# EAGLE schematic LedCtlV2 (EAGLE 6.6.0)
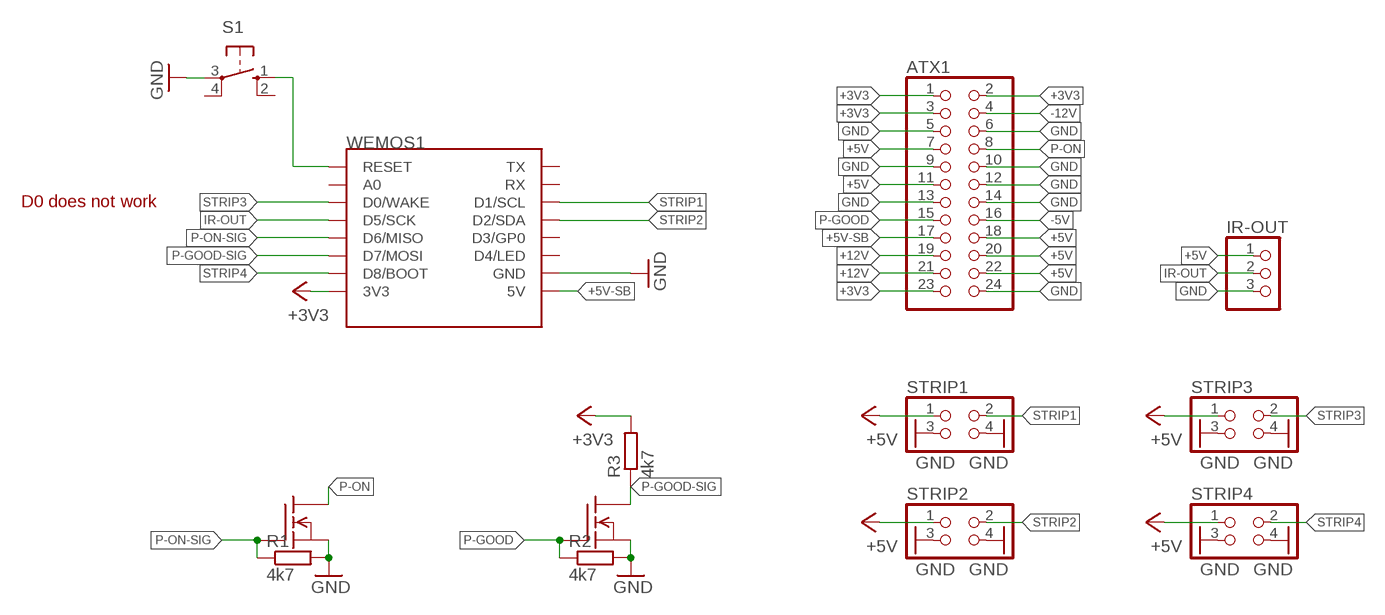
[diagram p0: schematic, sheet 1]

## Parts
ATX1  PINHD-2X12_2.54  [2X12]
IR-OUT  PINHD-1X03_2.54-S  [1X03-S]
Q1  FQN1N50CI  [TO92-INLINE]
Q2  FQN1N50CI  [TO92-INLINE]
R1  4k7  R-EU_0207/10  [0207/10]
R2  4k7  R-EU_0207/10  [0207/10]
R3  4k7  R-EU_0207/10  [0207/10]
S1  10-XX  [B3F-10XX]
STRIP1  PINHD-2X02_2.54  [2X02]
STRIP2  PINHD-2X02_2.54  [2X02]
STRIP3  PINHD-2X02_2.54  [2X02]
STRIP4  PINHD-2X02_2.54  [2X02]
WEMOS1  WEMOS-D1-MINI  [WEMOS-D1-MINI]

## Nets
+3V3: ATX1.1 ATX1.2 ATX1.3 ATX1.23 R3.2 WEMOS1.3V3
+5V: ATX1.7 ATX1.11 ATX1.18 ATX1.20 ATX1.22 IR-OUT.1 STRIP1.1 STRIP2.1 STRIP3.1 STRIP4.1
+5V-SB: ATX1.17 WEMOS1.5V
+12V: ATX1.19 ATX1.21
-5V: ATX1.16
-12V: ATX1.4
GND: ATX1.5 ATX1.6 ATX1.9 ATX1.10 ATX1.12 ATX1.13 ATX1.14 ATX1.24 IR-OUT.3 Q1.3(S) Q2.3(S) R1.2 R2.2 S1.3(P) STRIP1.3 STRIP1.4 STRIP2.3 STRIP2.4 STRIP3.3 STRIP3.4 STRIP4.3 STRIP4.4 WEMOS1.GND
IR-OUT: IR-OUT.2 WEMOS1.D5(D5/SCK)
N$1: S1.1(S) WEMOS1.RESET
P-GOOD: ATX1.15 Q2.2(G) R2.1
P-GOOD-SIG: Q2.1(D) R3.1 WEMOS1.D7(D7/MOSI)
P-ON: ATX1.8 Q1.1(D)
P-ON-SIG: Q1.2(G) R1.1 WEMOS1.D6(D6/MISO)
STRIP1: STRIP1.2 WEMOS1.D1(D1/SCL)
STRIP2: STRIP2.2 WEMOS1.D2(D2/SDA)
STRIP3: STRIP3.2 WEMOS1.D0(D0/WAKE)
STRIP4: STRIP4.2 WEMOS1.D8(D8/BOOT)
Unconnected: S1.2(S1) S1.4(P1) WEMOS1.A0 WEMOS1.D3(D3/GP0) WEMOS1.D4(D4/LED) WEMOS1.RX WEMOS1.TX

## Notes on the sheet
- D0 does not work

## Library data of the parts
ATX1 = pinhead-2:PINHD-2X12: PIN HEADER
IR-OUT = pinhead-2:PINHD-1X03: PIN HEADER
Q1 Q2 = adafruit:FQN1N50C: N-Channel Enhancement MOSFET 500V, 0.4A, 6.0 Ohm
R1-R3 = rcl:R-EU_: RESISTOR, European symbol
S1 = switch-omron:10-XX: OMRON SWITCH; MPN: B3F-1000; OC_FARNELL: 176432; OC_NEWARK: 36M3542
STRIP1-STRIP4 = pinhead-2:PINHD-2X02: PIN HEADER
WEMOS1 = esp8266modules:WEMOS-D1-MINI: WeMos.cc D1 mini ESP8266 module